# Altium schematic sheet Sheet2.SchDoc
size A
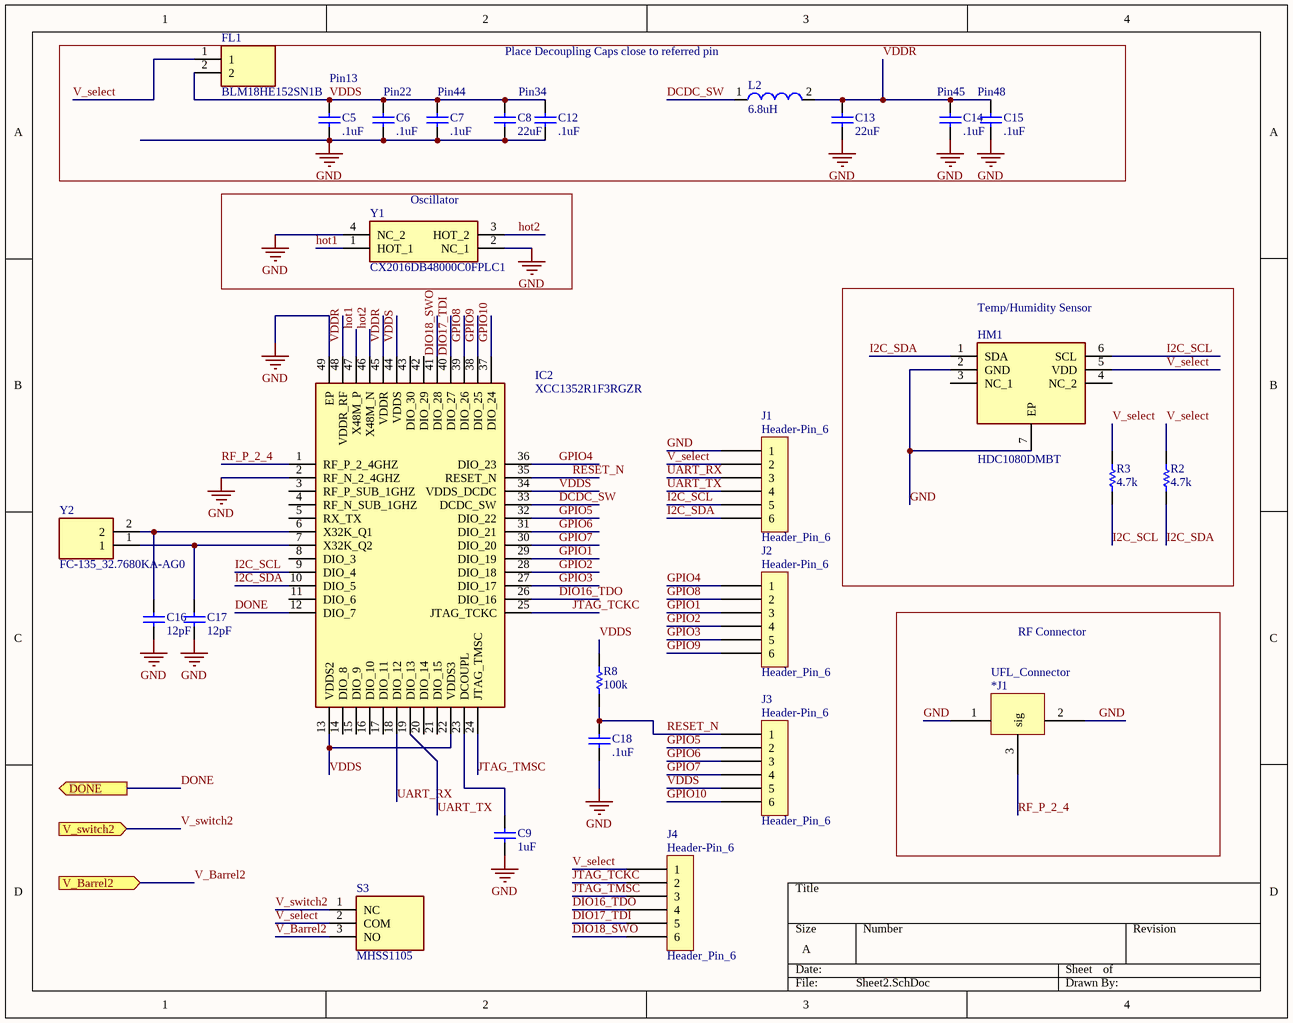
[diagram p0: Sheet2.SchDoc]

## Parts
*J1  UFL_Connector  [UFL_Connector]
C5  .1uF  [CAPC1608X90X35ML10T15]
C6  .1uF  [CAPC1608X90X35ML10T15]
C7  .1uF  [CAPC1608X90X35ML10T15]
C8  22uF  [CAPC1608X90X35ML10T15]
C9  1uF  [CAPC1608X90X35ML10T15]
C12  .1uF  [CAPC1608X90X35ML10T15]
C13  22uF  [CAPC1608X90X35ML10T15]
C14  .1uF  [CAPC1608X90X35ML10T15]
C15  .1uF  [CAPC1608X90X35ML10T15]
C16  12pF  [CAPC1608X90X35ML10T15]
C17  12pF  [CAPC1608X90X35ML10T15]
C18  .1uF  [CAPC1608X90X35ML10T15]
FL1  BLM18HE152SN1B  [BEADC1608X95N]
HM1  HDC1080DMBT  [SON100P300X300X80-7N]
IC2  XCC1352R1F3RGZR  [QFN50P700X700X100-49N-D]
J1  Header_Pin_6  [Header_Pin_6]
J2  Header_Pin_6  [Header_Pin_6]
J3  Header_Pin_6  [Header_Pin_6]
J4  Header_Pin_6  [Header_Pin_6]
L2  6.8uH  [SMD 0603_A]
R2  4.7k  [RESC1609X50X30LL10T20]
R3  4.7k  [RESC1609X50X30LL10T20]
R8  100k  [RESC1609X50X30LL10T20]
S3  MHSS1105  [MHSS1105]
Y1  CX2016DB48000C0FPLC1  [CX2016DB48000C0FPLC1]
Y2  FC-135_32.7680KA-AG0  [FC135327680KAAG0]

## Blocks framed on the sheet
Oscillator: Y1
Temp/Humidity Sensor: HM1 R2 R3
RF Connector: *J1

## Ports
DONE (out), V_Barrel2 (in), V_switch2 (in)

## Nets
GND: *J1.1 *J1.2 C5.1 C6.1 C7.1 C8.1 C9.1 C12.1 C13.1 C14.1 C15.1 C16.1 C17.1 C18.1 HM1.2(GND) HM1.7(EP) IC2.2(RF_N_2_4GHZ) IC2.49(EP) J1.1 Y1.2(NC_1) Y1.4(NC_2)
DCDC_SW: IC2.33(DCDC_SW) L2.1
DIO16_TDO: IC2.26(DIO_16) J4.4
DIO17_TDI: IC2.40(DIO_27) J4.5
DIO18_SWO: IC2.41(DIO_28) J4.6
DONE: IC2.12(DIO_7) ; port DONE
GPIO1: IC2.29(DIO_19) J2.3
GPIO2: IC2.28(DIO_18) J2.4
GPIO3: IC2.27(DIO_17) J2.5
GPIO4: IC2.36(DIO_23) J2.1
GPIO5: IC2.32(DIO_22) J3.2
GPIO6: IC2.31(DIO_21) J3.3
GPIO7: IC2.30(DIO_20) J3.4
GPIO8: IC2.39(DIO_26) J2.2
GPIO9: IC2.38(DIO_25) J2.6
GPIO10: IC2.37(DIO_24) J3.6
hot1: IC2.47(X48M_P) Y1.1(HOT_1)
hot2: IC2.46(X48M_N) Y1.3(HOT_2)
I2C_SCL: HM1.6(SCL) IC2.9(DIO_4) J1.5 R3.1
I2C_SDA: HM1.1(SDA) IC2.10(DIO_5) J1.6 R2.1
JTAG_TCKC: IC2.25(JTAG_TCKC) J4.2
JTAG_TMSC: IC2.24(JTAG_TMSC) J4.3
RESET_N: C18.2 IC2.35(RESET_N) J3.1 R8.2
RF_P_2_4: *J1.3(sig) IC2.1(RF_P_2_4GHZ)
UART_RX: IC2.18(DIO_12) J1.3
UART_TX: IC2.19(DIO_13) J1.4
V_Barrel2: S3.3(NO) ; port V_Barrel2
V_select: FL1.1 HM1.5(VDD) J1.2 J4.1 R2.2 R3.2 S3.2(COM)
V_switch2: S3.1(NC) ; port V_switch2
VDDR: C13.2 C14.2 C15.2 IC2.45(VDDR) IC2.48(VDDR_RF) L2.2
VDDS: C5.2 C6.2 C7.2 C8.2 C12.2 FL1.2 IC2.13(VDDS2) IC2.22(VDDS3) IC2.34(VDDS_DCDC) IC2.44(VDDS) J3.5 R8.1
NetC9_2: C9.2 IC2.23(DCOUPL)
NetC16_2: C16.2 IC2.6(X32K_Q1) Y2.2
NetC17_2: C17.2 IC2.7(X32K_Q2) Y2.1

Not connected (* = marked no-connect by the designer): HM1 3(NC_1) 4(NC_2); IC2 3(RF_P_SUB_1GHZ) 4(RF_N_SUB_1GHZ) 5(RX_TX) 8(DIO_3) 11(DIO_6) 14(DIO_8) 15(DIO_9) 16(DIO_10) 17(DIO_11) 20(DIO_14) 21(DIO_15) 42(DIO_29) 43(DIO_30)

## Notes on the sheet
- Pin13
- (near C6) Pin22
- (near C7) Pin44
- Place Decoupling Caps close to referred pin
- Pin34
- (near C14) Pin45
- (near C15) Pin48
- (in symbol Header_Pin_6) Header-Pin_6

## Library data of the parts
*J1 = UFL_Connector: CONN U.FL RCPT STR 50 OHM SMD
C5-C9 C12-C18 = CMP-2000-04945-1: Chip Capacitor, 22 pF, +/- 5%, 50 V, -55 to 125 degC, 0603 (1608 Metric), RoHS, Tape and Reel; Manufacturer: Murata; Capacitance: 22pF; Rated Voltage: 50V; Dielectric: C0G; Manufacturer URL: http://www.murata.com/; Datasheet Version: Jul-06; Package Reference: 603; Tolerance (%): ±5%; Case Size/Dimension: 0603; Package Description: 2-Pin Surface Mount Device, Body 1.6 x 0.8 mm; Datasheet URL: https://datasheet.ciiva.com/11786/0900766b807a1cab-11786398.pdf
FL1 = BLM18HE152SN1B: Filter; Manufacturer_Name: Murata Electronics; Datasheet Link: https://www.murata.com/en-us/products/productdetail?partno=BLM18HE152SN1%23; Height: 0.95mm; Manufacturer_Part_Number: BLM18HE152SN1B; Mouser Part Number: N/A; Mouser Price/Stock: https://www.mouser.com/Search/Refine.aspx?Keyword=N%2FA
HM1 = HDC1080DMBT: Hygrometer; Manufacturer_Name: Texas Instruments; Datasheet Link: http://www.mouser.com/ds/2/405/hdc1080-844688.pdf; Height: 0.8mm; Manufacturer_Part_Number: HDC1080DMBT; Mouser Part Number: 595-HDC1080DMBT; Mouser Price/Stock: https://www.mouser.com/Search/Refine.aspx?Keyword=595-HDC1080DMBT; RS Part Number: 1330170P; RS Price/Stock: http://uk.rs-online.com/web/p/products/1330170P
IC2 = XCC1352R1F3RGZR: Integrated Circuit; Manufacturer_Name: Texas Instruments; Datasheet Link: http://www.ti.com/lit/gpn/cc1352r; Height: 1mm; Manufacturer_Part_Number: XCC1352R1F3RGZR
L2 = CMP-1392-00021-1: Power Multilayer Inductor WE-PMI, L=0.47 µH; PartNumber: 74479763147; Manufacturer: Wuerth Elektronik; Inductance: 0.47 ÂµH; ComponentLink1Description: Manufacturer URL; PackageReference: SMD 0603_A; ComponentLink2Description: Datasheet; ComponentLink2URL: http://katalog.we-online.de/kataloge/eisos/media/pdf/74479763147.pdf; ComponentLink1URL: http://www.we-online.com
R2 R3 R8 = CMP-2000-03820-1: Part Number: CRCW0603100KFKEA; Manufacturer: Vishay Dale
S3 = MHSS1105: Switch; Manufacturer_Name: Apem; Datasheet Link: https://componentsearchengine.com/Datasheets/2/MHSS1105.pdf; Height: 4mm; Manufacturer_Part_Number: MHSS1105; Mouser Part Number: 642-MHSS1105; Mouser Price/Stock: https://www.mouser.com/Search/Refine.aspx?Keyword=642-MHSS1105
Y1 = CX2016DB48000C0FPLC1: Crystal or Oscillator; Manufacturer_Name: Kyocera Electronic Components; Datasheet Link: https://componentsearchengine.com/Datasheets/1/CX2016DB48000C0FPLC1.pdf; Manufacturer_Part_Number: CX2016DB48000C0FPLC1; Mouser Part Number: 581-CX2016DB48CFPLC1; Mouser Price/Stock: https://www.mouser.com/Search/Refine.aspx?Keyword=581-CX2016DB48CFPLC1
Y2 = FC-135_32.7680KA-AG0: Crystal or Oscillator; Manufacturer_Name: Epson Timing; Manufacturer_Part_Number: FC-135 32.7680KA-AG0; Datasheet Link: https://support.epson.biz/td/api/doc_check.php?dl=brief_FC-135&lang=en/.pdf; Height: 0mm; Mouser Part Number: 732-FC135-32.76KAAG0; Mouser Price/Stock: https://www.mouser.com/Search/Refine.aspx?Keyword=732-FC135-32.76KAAG0